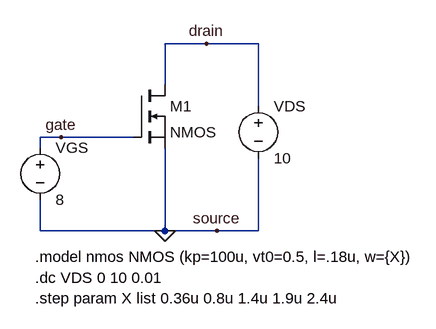
[diagram p0: schematic part3_b_vds_sweep.asc]
part3_b_vds_sweep.asc, the LTspice schematic file:
Version 4
SHEET 1 880 680
WIRE 160 48 96 48
WIRE 240 48 160 48
WIRE 96 112 96 48
WIRE 240 144 240 48
WIRE -64 192 -96 192
WIRE 48 192 -64 192
WIRE -96 208 -96 192
WIRE -96 336 -96 288
WIRE 96 336 96 208
WIRE 96 336 -96 336
WIRE 176 336 96 336
WIRE 240 336 240 224
WIRE 240 336 176 336
FLAG 96 336 0
FLAG -64 192 gate
FLAG 160 48 drain
FLAG 176 336 source
SYMBOL voltage -96 192 R0
SYMATTR InstName VGS
SYMATTR Value 8
SYMBOL voltage 240 128 R0
SYMATTR InstName VDS
SYMATTR Value 10
SYMBOL nmos 48 112 R0
SYMATTR InstName M1
TEXT -104 376 Left 2 !.model nmos NMOS (kp=100u, vt0=0.5, l=.18u, w={X})
TEXT -104 408 Left 2 !.dc VDS 0 10 0.01
TEXT -104 440 Left 2 !.step param X list 0.36u 0.8u 1.4u 1.9u 2.4u

The netlist it stands for:
* part3_b_vds_sweep.asc
VGS gate 0 8
VDS drain 0 10
M1 drain gate 0 0 NMOS
.model NMOS NMOS
.model PMOS PMOS
.lib standard.mos
.model nmos NMOS (kp=100u, vt0=0.5, l=.18u, w={X})
.dc VDS 0 10 0.01
.step param X list 0.36u 0.8u 1.4u 1.9u 2.4u
.backanno
.end

* Results of the author's LTspice run, read from the files saved beside the schematic
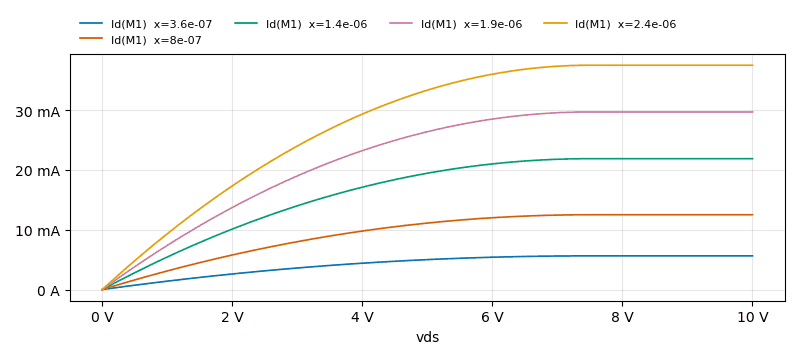
[diagram p1: DC transfer characteristic of part3_b_vds_sweep.asc, plotted from the saved traces]
* DC transfer characteristic, 5 runs:
*   Id(M1) [x=3.6e-07]: 0 A at vds=0 V, 5.625 mA at vds=10 V, min 0 A, max 5.625 mA
*   Id(M1) [x=8e-07]: 0 A at vds=0 V, 12.5 mA at vds=10 V, min 0 A, max 12.5 mA
*   Id(M1) [x=1.4e-06]: 0 A at vds=0 V, 21.87 mA at vds=10 V, min 0 A, max 21.87 mA
*   Id(M1) [x=1.9e-06]: 0 A at vds=0 V, 29.69 mA at vds=10 V, min 0 A, max 29.69 mA
*   Id(M1) [x=2.4e-06]: 0 A at vds=0 V, 37.5 mA at vds=10 V, min 0 A, max 37.5 mA